# EAGLE design AWS R1 (EAGLE 7.6.0)
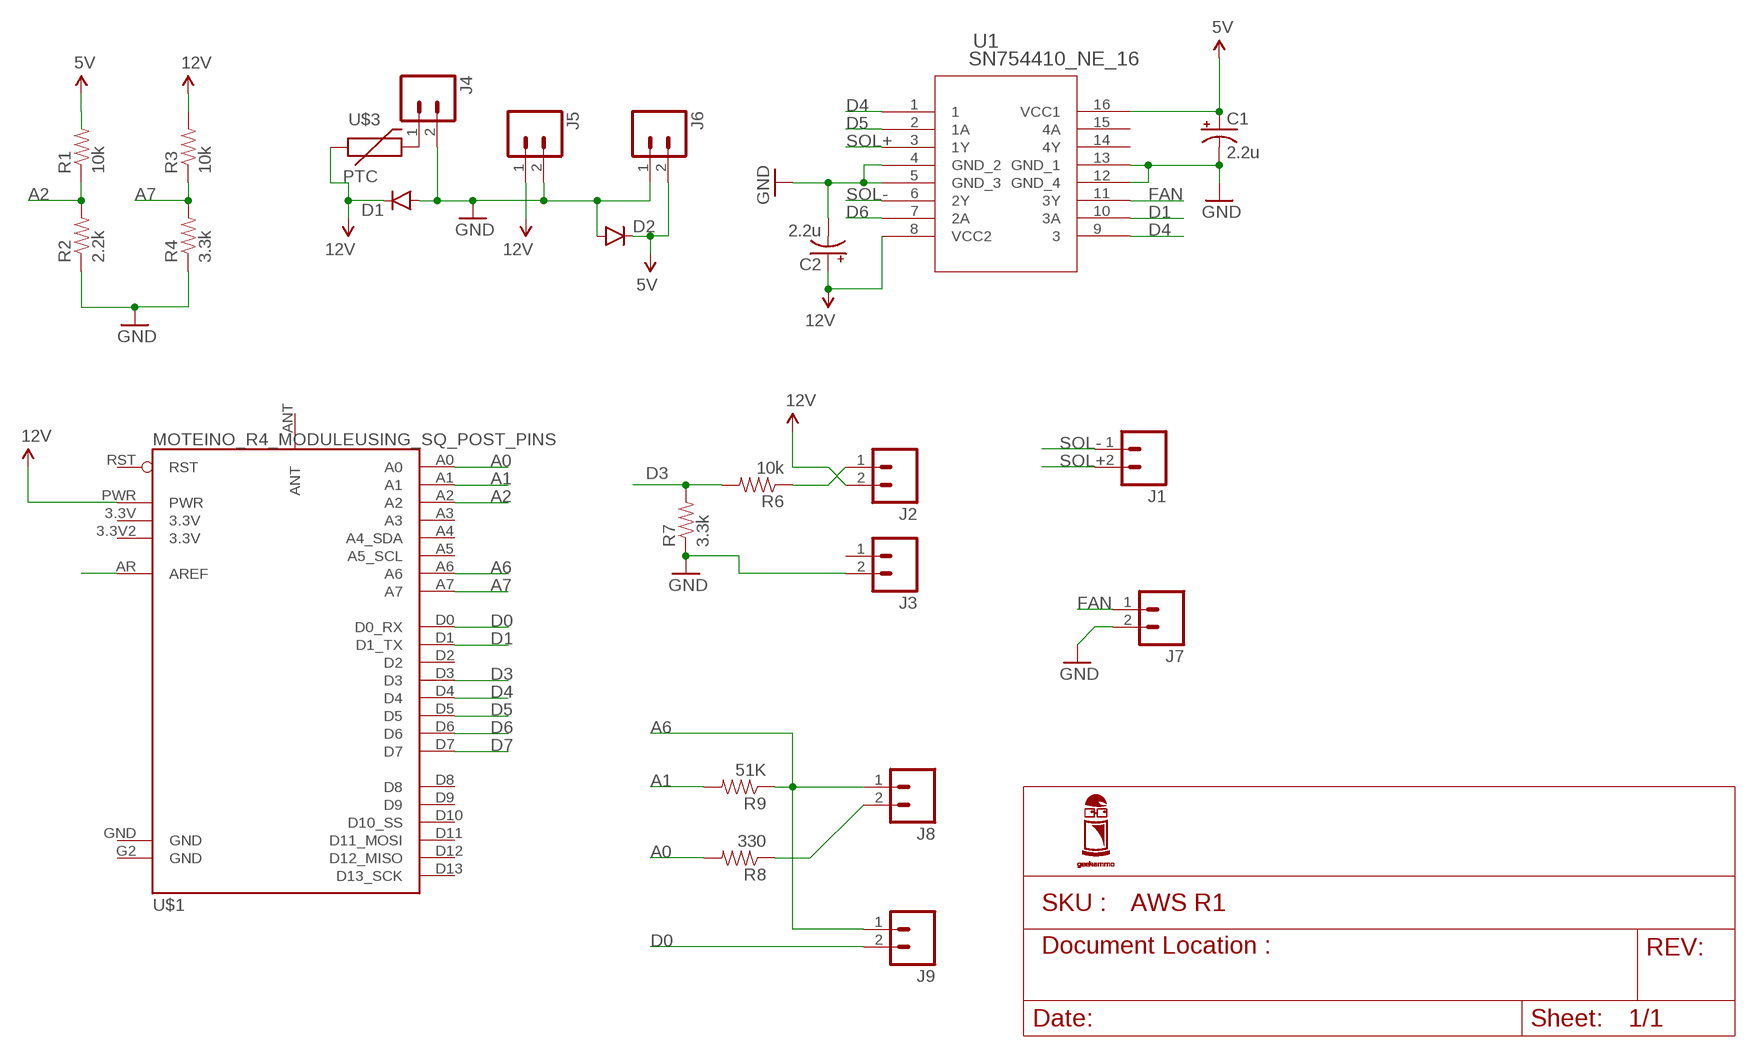
[diagram p0: schematic, sheet 1]

## Parts
C1  2.2u  CAP_POLPTH1  [CPOL-RADIAL-100UF-25V]
C2  2.2u  CAP_POLPTH1  [CPOL-RADIAL-100UF-25V]
D1  DIODEPTH  [DIODE-1N4001]
D2  DIODEPTH  [DIODE-1N4001]
J1  M025MM  [SCREWTERMINAL-5MM-2]
J2  M025MM  [SCREWTERMINAL-5MM-2]
J3  M025MM  [SCREWTERMINAL-5MM-2]
J4  M025MM  [SCREWTERMINAL-5MM-2]
J5  M025MM  [SCREWTERMINAL-5MM-2]
J6  M025MM  [SCREWTERMINAL-5MM-2]
J7  M025MM  [SCREWTERMINAL-5MM-2]
J8  M025MM  [SCREWTERMINAL-5MM-2]
J9  M025MM  [SCREWTERMINAL-5MM-2]
R1  10k  RESISTORPTH-1/4W  [AXIAL-0.4]
R2  2.2k  RESISTORPTH-1/4W  [AXIAL-0.4]
R3  10k  RESISTORPTH-1/4W  [AXIAL-0.4]
R4  3.3k  RESISTORPTH-1/4W  [AXIAL-0.4]
R6  10k  RESISTORPTH-1/4W  [AXIAL-0.4]
R7  3.3k  RESISTORPTH-1/4W  [AXIAL-0.4]
R8  330  RESISTORPTH-1/4W  [AXIAL-0.4]
R9  51K  RESISTORPTH-1/4W  [AXIAL-0.4]
U1  SN754410_NE_16  [NE16]
U$1  MOTEINO_R4_MODULEUSING_SQ_POST_PINS  [MOTEINTO_R4_SQ]
U$3  PTC  [MC331XX]

## Nets
5V: C1.1(+) D2.C J6.2 R1.P$2 U1.16(VCC1)
12V: C2.1(+) D1.C J2.2 J5.1 R3.P$2 U1.8(VCC2) U$1.PWR U$3.P$1
A0: R8.P$2 U$1.A0
A1: R9.P$2 U$1.A1
A2: R1.P$1 R2.P$2 U$1.A2
A6: J8.1 J9.1 R9.P$1 U$1.A6
A7: R3.P$1 R4.P$2 U$1.A7
D0: J9.2 U$1.D0(D0_RX)
D1: U1.10(3A) U$1.D1(D1_TX)
D3: R6.P$2 R7.P$2 U$1.D3
D4: U1.1 U1.9 U$1.D4
D5: U1.2(1A) U$1.D5
D6: U1.7(2A) U$1.D6
D7: U$1.D7
FAN: J7.1 U1.11(3Y)
GND: C1.2(-) C2.2(-) D1.A D2.A J3.2 J4.2 J5.2 J6.1 J7.2 R2.P$1 R4.P$1 R7.P$1 U1.4(GND_2) U1.5(GND_3) U1.12(GND_4) U1.13(GND_1)
N$1: J8.2 R8.P$1
N$2: J2.1 R6.P$1
N$3: U$1.AR(AREF)
N$4: J4.1 U$3.P$2
SOL+: J1.2 U1.3(1Y)
SOL-: J1.1 U1.6(2Y)
Unconnected: J3.1 U1.14(4Y) U1.15(4A) U$1.3.3V U$1.3.3V2(3.3V) U$1.A3 U$1.A4(A4_SDA) U$1.A5(A5_SCL) U$1.ANT U$1.D2 U$1.D8 U$1.D9 U$1.D10(D10_SS) U$1.D11(D11_MOSI) U$1.D12(D12_MISO) U$1.D13(D13_SCK) U$1.RST

## Power pins joined to a net without a drawn wire
GND: U$1.G2(GND) U$1.GND

## Library data of the parts
C1 C2 = SparkFun-Capacitors:CAP_POL: Capacitor Polarized These are standard SMD and PTH capacitors. Normally 10uF, 47uF, and 100uF in electrolytic and tantalum varieties. Always verify the external diameter of the through hole cap, it varies with capacity, voltage, and manufacturer. The EIA devices should be standard.
D1 D2 = SparkFun-DiscreteSemi:DIODE: Diode These are standard reverse protection diodes and small signal diodes. SMA package can handle up to about 1A. SOD-323 can handle about 200mA. What the SOD-323 package when ordering, there are some mfgs out there that are 5-pin packages.
J1-J9 = SparkFun-Connectors:M02: Standard 2-pin 0.1" header. Use with - straight break away headers ( PRT-00116) - right angle break away headers (PRT-00553) - swiss pins (PRT-00743) - machine pins (PRT-00117) - female headers (PRT-00115) Molex polarized connector foot print use with: PRT-08233 with associated crimp pins and housings. 2.54_SCREWTERM for use with PRT-10571. 3.5mm Screw Terminal footprints for PRT-08084 5mm Screw Terminal footprints for use with PRT-08432; STOREFRONT_ID: PRT-08432
R1-R4 R6-R9 = SparkFun-Resistors:RESISTOR: Resistor Basic schematic elements and footprints for 0603, 1206, and PTH resistors.
U1 = SN754410:SN754410_NE_16; DATASHEETURL: http://www.ti.com/lit/gpn/SN754410; DESCRIPTION: Quadruple Half-H Drivers; FAMILY_NAME: PERIPHERAL DRIVER AND ACTUATOR; GENERIC_PART_NUMBER: SN754410; INDUSTRY_STD_PKG_TYPE: PDIP; MANUFACTURER: Texas Instruments; PACKAGE_DESIGNATOR: NE; PIN_COUNT: 16
U$1 = MoteinoR4Mod:MOTEINO_R4_MODULE: Moteino Module as a device. Available in two footprints, one with pads for 0.025" sq pins, and one using wire pins.
U$3 = GeekAmmo:PTC: PTC Resettable Fuse

## Board
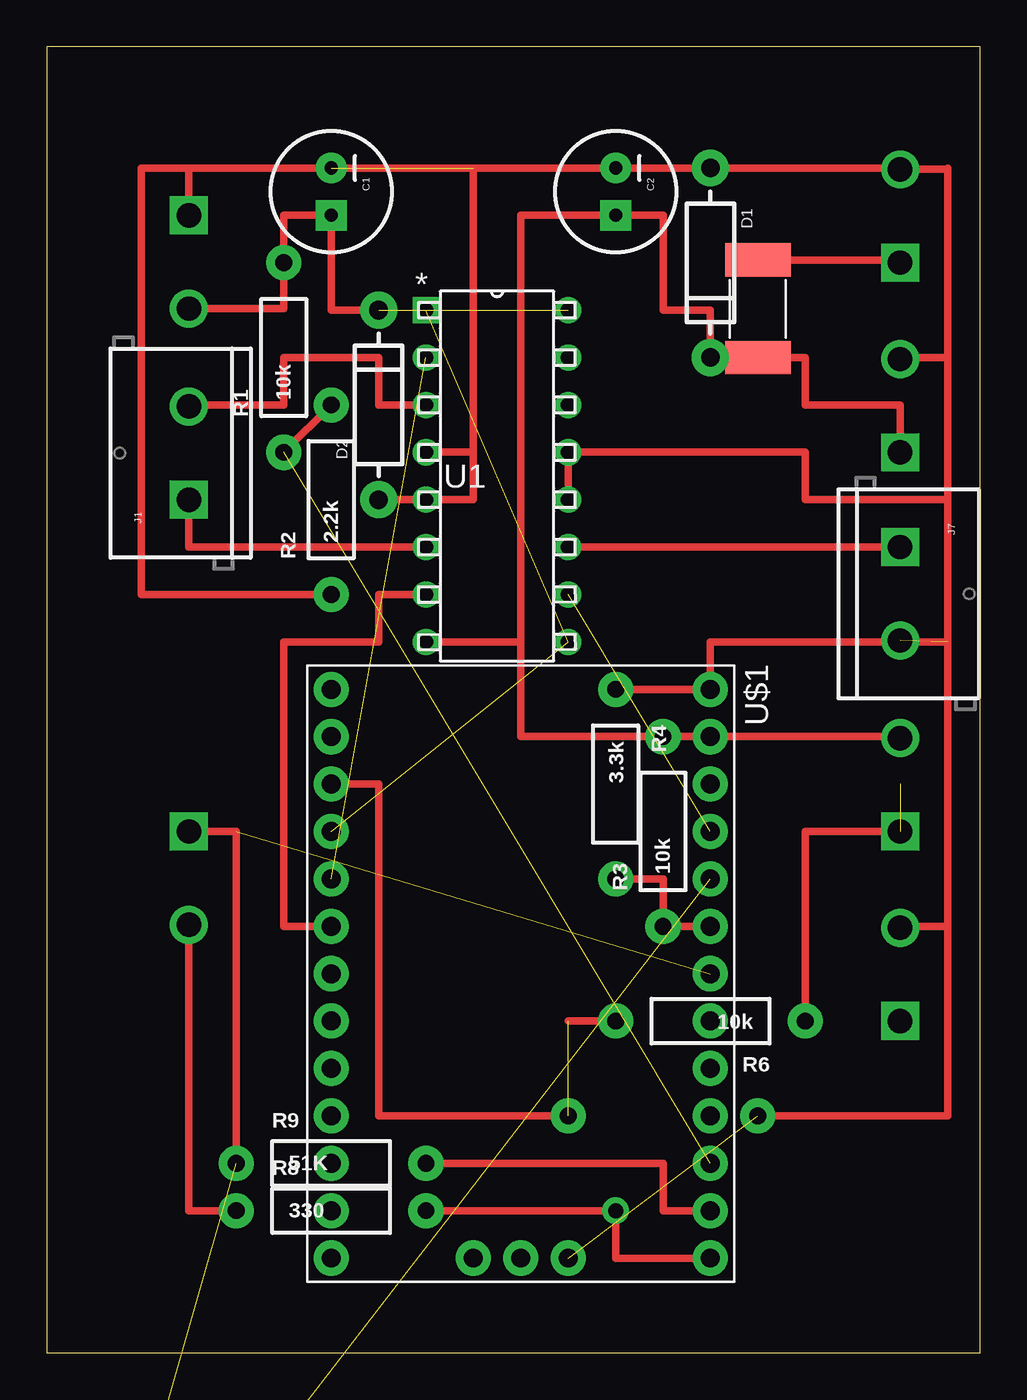
[diagram p1: board, top side]
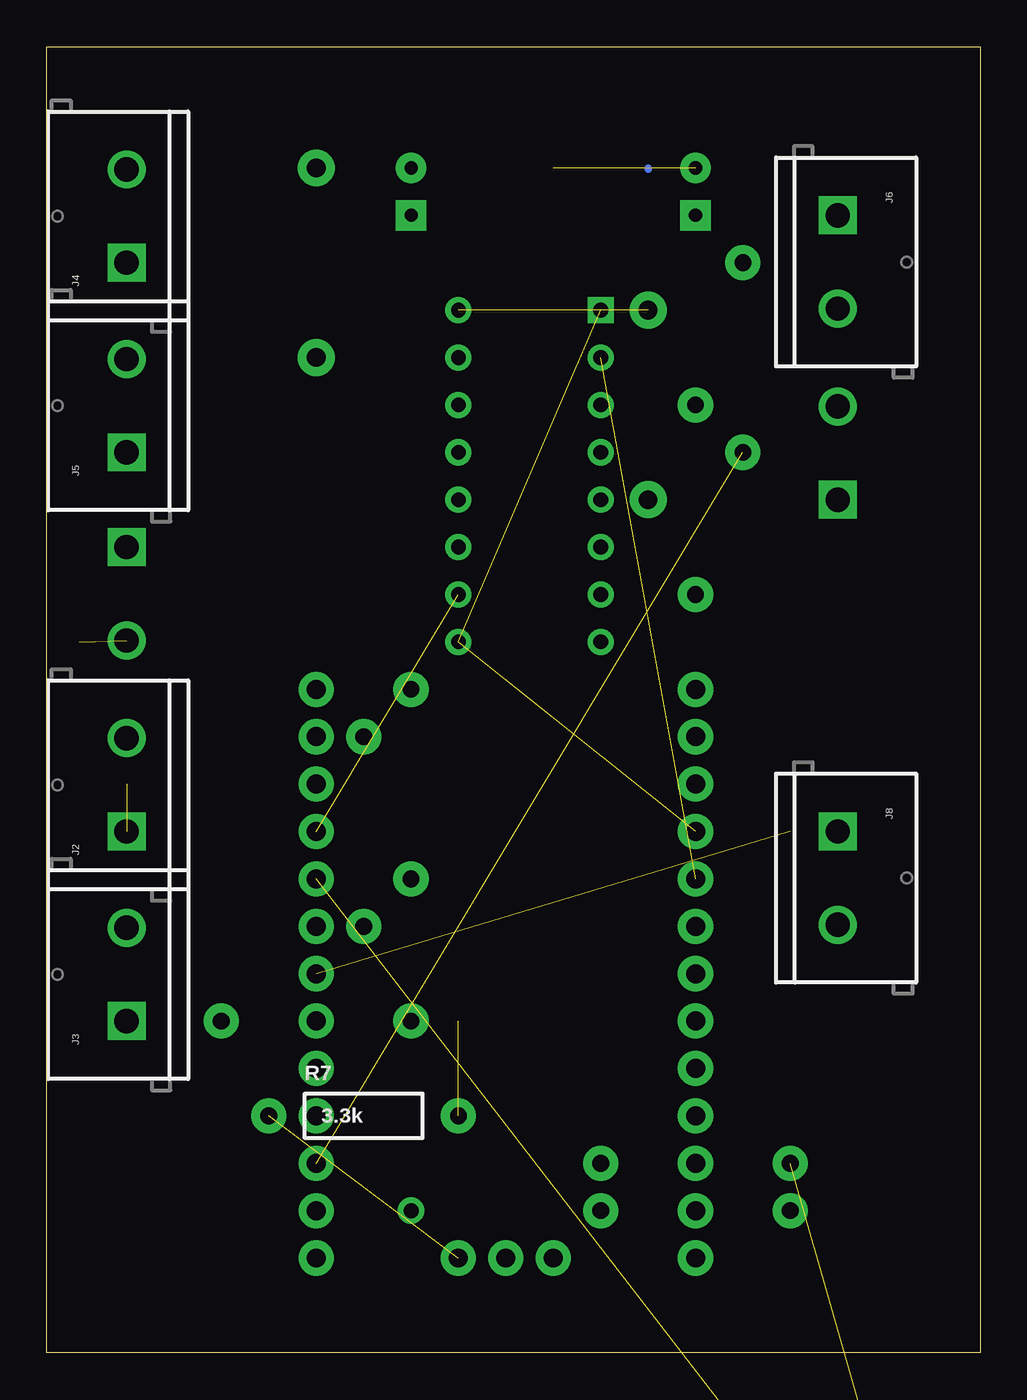
[diagram p2: board, bottom side, seen from below]

Size 50 x 70 mm. Coordinates in mm from the lower left corner, seen from the top.
Outline: 0,0 50,0 50,70 0,70 0,0
Copper layers (1*16): Top 0.035mm / dielectric 1.5mm / Bottom 0.035mm
Design rules "SparkFun": minimum track width 8mil, minimum drill 20mil, track to track 8mil, track to pad 8mil, pad to pad 8mil, via to via 8mil, smd to smd 8mil, copper to edge 10mil, drill to drill 8mil, minimum pad ring 12mil, minimum via ring 10mil, stop-mask expansion 4mil, vias tented up to drill 25mil, thermal gap 10mil

### Footprints (pad centres in the part's own frame; a part is rotated, then mirrored left to right if it is on the bottom)
CPOL-RADIAL-100UF-25V = drill 0.7 pad 1.651 square: 1 1.27,0 | drill 0.7 pad 1.651: 2 -1.27,0
DIODE-1N4001 = drill 1 pad 1.981: A -5.08,0; C 5.08,0
SCREWTERMINAL-5MM-2 = drill 1.3 pad 2.032 square: 1 0,0 | drill 1.3 pad 2.032: 2 5,0
AXIAL-0.4 = drill 0.9 pad 1.88: P$1 -5.08,0; P$2 5.08,0
NE16 = drill 0.787 pad 1.295 square: 1 -7.62,17.78 | drill 0.787 pad 1.295: 2 -7.62,15.24; 3 -7.62,12.7; 4 -7.62,10.16; 5 -7.62,7.62; 6 -7.62,5.08; 7 -7.62,2.54; 8 -7.62,0; 9 0,0; 10 0,2.54; 11 0,5.08; 12 0,7.62; 13 0,10.16; 14 0,12.7; 15 0,15.24; 16 0,17.78
MOTEINTO_R4_SQ = drill 1.016 pad 1.88: 3.3V -10.16,10.16; 3.3V2 15.24,0; A0 15.24,10.16; A1 12.7,10.16; A2 10.16,10.16; A3 7.62,10.16; A4 5.08,10.16; A5 2.54,10.16; A6 0,10.16; A7 -2.54,10.16; AR 15.24,-2.54; D0 -5.08,10.16; D1 -7.62,10.16; D2 -12.7,-10.16; D3 -10.16,-10.16; D4 -7.62,-10.16; D5 -5.08,-10.16; D6 -2.54,-10.16; D7 0,-10.16; D8 2.54,-10.16; D9 5.08,-10.16; D10 7.62,-10.16; D11 10.16,-10.16; D12 12.7,-10.16; D13 15.24,-10.16; G2 15.24,2.54; GND -15.24,10.16; PWR -12.7,10.16; RST -15.24,-10.16 | drill 0.8: ANT 12.7,5.08
MC331XX = smd 1.78 x 3.5: P$1 0,0; P$2 5.23,0

### Placement (x,y rotation side)
C1  15.24,62.23 270 top
C2  30.48,62.23 270 top
D1  35.56,58.42 270 top
D2  17.78,50.8 90 top
J1  7.62,45.72 90 top
J2  45.72,27.94 90 bottom
J3  45.72,17.78 90 bottom
J4  45.72,58.42 90 bottom
J5  45.72,48.26 90 bottom
J6  7.62,60.96 270 bottom
J7  45.72,43.18 270 top
J8  7.62,27.94 270 bottom
J9  5.08,-7.62 0 top  (outside the outline)
R1  12.7,53.34 90 top
R2  15.24,45.72 90 top
R3  33.02,27.94 90 top
R4  30.48,30.48 270 top
R6  35.56,17.78 180 top
R7  33.02,12.7 0 bottom
R8  15.24,7.62 0 top
R9  15.24,10.16 0 top
U1  27.94,38.1 0 top
U$1  25.4,20.32 270 top
U$3  38.1,53.34 90 top

### Tracks (layer width: path | path; a pad name or v marks a point on that pad's centre or on a via)
5V  (1 unrouted)
  Top 0.406: J6.2 12.7,55.96 R1.P$2 12.7,60.96 C1.1 15.24,55.88 D2.C
12V
  Top 0.406: U1.8 25.4,38.1 | 25.4,38.1 25.4,60.96 C2.1 33.02,60.96 33.02,55.88 35.56,55.88 D1.C U$3.P$1 40.64,53.34 40.64,50.8 45.72,50.8 J5.1 | 25.4,38.1 25.4,33.02 R3.P$2 U$1.PWR 38.1,33.02 45.72,33.02 J2.2
A0
  Top 0.406: R8.P$2 30.48,7.62 30.48,5.08 U$1.A0
A1
  Top 0.406: R9.P$2 33.02,10.16 33.02,7.62 U$1.A1
A2  (1 unrouted)
  Top 0.406: R2.P$2 R1.P$1
A6  (2 unrouted)
  Top 0.406: R9.P$1 10.16,27.94 J8.1
A7
  Top 0.406: R4.P$2 33.02,25.4 R3.P$1 U$1.A7
D0  (1 unrouted)
D1  (1 unrouted)
D3  (1 unrouted)
  Top 0.406: R6.P$2 27.94,17.78 | R7.P$2 17.78,12.7 17.78,30.48 U$1.D3
D4  (2 unrouted)
D5  (1 unrouted)
D6
  Top 0.406: U1.7 17.78,40.64 17.78,38.1 12.7,38.1 12.7,22.86 U$1.D6
FAN
  Top 0.406: U1.11 J7.1
GND  (4 unrouted)
  Top 0.406: 48.26,63.42 J4.2 45.72,63.5 D1.A C2.2 22.86,63.5 | 48.26,63.42 48.26,63.5 | 48.26,63.42 48.26,53.34 | 48.26,53.34 45.72,53.34 J5.2 | 22.86,63.5 22.86,48.26 | 22.86,48.26 22.86,45.72 U1.5 D2.A | U1.4 22.86,48.26 | 48.26,53.34 48.26,45.72 | 48.26,45.72 48.26,38.1 | 48.26,38.1 35.56,38.1 U$1.GND R4.P$1 | J6.1 7.62,63.5 | 7.62,63.5 22.86,63.5 | R2.P$1 5.08,40.64 5.08,63.5 7.62,63.5 | 48.26,22.86 48.26,38.1 | 48.26,22.86 45.72,22.86 J3.2 | R7.P$1 48.26,12.7 48.26,22.86 | U1.12 U1.13 40.64,48.26 40.64,45.72 48.26,45.72
  Bottom 0.406: 17.78,63.5 17.78,63.42
N$1
  Top 0.406: J8.2 7.62,7.62 R8.P$1
N$2  (1 unrouted)
  Top 0.406: R6.P$1 40.64,27.94 J2.1
N$4
  Top 0.406: U$3.P$2 45.72,58.57 J4.1
SOL+
  Top 0.406: U1.3 17.78,50.8 17.78,53.34 12.7,53.34 12.7,50.8 7.62,50.8 J1.2
SOL-
  Top 0.406: U1.6 7.62,43.18 J1.1